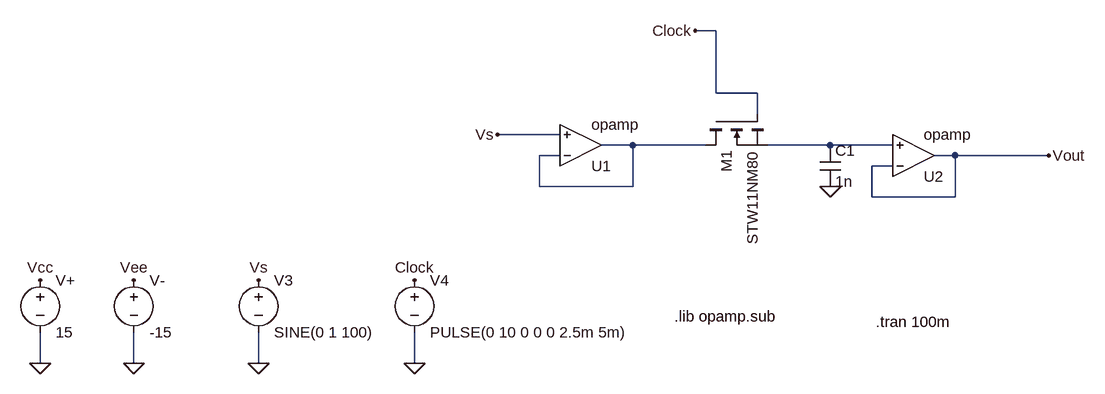
[diagram p0: schematic Sample&Hold.asc]
Sample&Hold.asc, the LTspice schematic file:
Version 4
SHEET 1 1556 680
WIRE 272 0 240 0
WIRE 272 96 272 0
WIRE 336 96 272 96
WIRE 336 128 336 96
WIRE 32 160 -64 160
WIRE 144 176 96 176
WIRE 256 176 144 176
WIRE 448 176 352 176
WIRE 544 176 448 176
WIRE 32 192 0 192
WIRE 448 192 448 176
WIRE 640 192 608 192
WIRE 784 192 640 192
WIRE 544 208 512 208
WIRE 0 240 0 192
WIRE 144 240 144 176
WIRE 144 240 0 240
WIRE 512 256 512 208
WIRE 640 256 640 192
WIRE 640 256 512 256
WIRE -768 512 -768 464
WIRE -624 512 -624 464
WIRE -432 512 -432 464
WIRE -192 512 -192 464
FLAG -768 512 0
FLAG -624 512 0
FLAG -432 512 0
FLAG -192 512 0
FLAG -768 384 Vcc
FLAG -624 384 Vee
FLAG -432 384 Vs
FLAG -192 384 Clock
FLAG -64 160 Vs
FLAG 240 0 Clock
FLAG 784 192 Vout
FLAG 448 240 0
SYMBOL voltage -768 368 R0
WINDOW 123 0 0 Left 0
WINDOW 39 0 0 Left 0
SYMATTR InstName V+
SYMATTR Value 15
SYMBOL voltage -624 368 R0
WINDOW 123 0 0 Left 0
WINDOW 39 0 0 Left 0
SYMATTR InstName V-
SYMATTR Value -15
SYMBOL voltage -432 368 R0
WINDOW 123 0 0 Left 0
WINDOW 39 0 0 Left 0
SYMATTR InstName V3
SYMATTR Value SINE(0 1 100)
SYMBOL voltage -192 368 R0
WINDOW 123 0 0 Left 0
WINDOW 39 0 0 Left 0
SYMATTR InstName V4
SYMATTR Value PULSE(0 10 0 0 0 2.5m 5m)
SYMBOL Opamps\\opamp 64 240 M180
SYMATTR InstName U1
SYMBOL Opamps\\opamp 576 256 M180
SYMATTR InstName U2
SYMBOL cap 432 176 R0
SYMATTR InstName C1
SYMATTR Value 1n
SYMBOL nmos 256 128 M90
SYMATTR InstName M1
SYMATTR Value STW11NM80
TEXT 518 448 Left 2 !.tran 100m
TEXT 208 440 Left 2 !.lib opamp.sub

The netlist it stands for:
* Sample&Hold.asc
V+ Vcc 0 15
V- Vee 0 -15
V3 Vs 0 SINE(0 1 100)
V4 Clock 0 PULSE(0 10 0 0 0 2.5m 5m)
XU1 N001 Vs N001 opamp Aol=100K GBW=10Meg  ; pins invin noninvin out
XU2 Vout N002 Vout opamp Aol=100K GBW=10Meg  ; pins invin noninvin out
C1 N002 0 1n
M1 N001 Clock N002 N002 STW11NM80
.model NMOS NMOS
.model PMOS PMOS
.lib standard.mos
.tran 100m
.lib opamp.sub
.backanno
.end